# Altium schematic sheet IOProtection.SchDoc: Top Level
size A3; CompanyName: NOT USED; SheetNumber: 0; SheetTotal: 0; PageSetup: Record=PageOptions|CenterHorizontal=True|CenterVertical=True|PrintScale=1.00|XCorrection=1.00|YCorrection=1.00|PrintKind=0|BorderSize=5000000|LeftOffset=0|BottomOffset=0|Orientation=2|PaperLength=1000|PaperWidth=1000|Scale=100|PaperSource=7|PrintQuality=-4|MediaType=1|DitherType=10|PaperKind=A3|PrintScaleMode=0
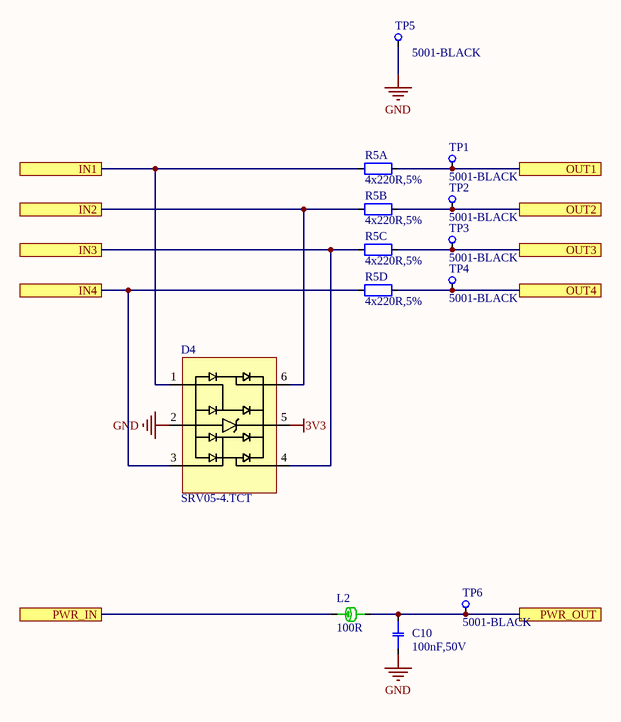
[diagram p0: IOProtection.SchDoc]

## Parts
C10  100nF,50V  [CAPC1608X09N_0603]
D4  SRV05-4.TCT  [SOT95P280X145-6N_SOT23-6]
L2  100R  [INDC1608X10N_0603]
R5  4x220R,5%  [RESCAF80P32X16X60N]  (parts A,B,C,D of 4)
TP1  5001-BLACK  [TP_5002]  (no BOM)
TP2  5001-BLACK  [TP_5002]  (no BOM)
TP3  5001-BLACK  [TP_5002]  (no BOM)
TP4  5001-BLACK  [TP_5002]  (no BOM)
TP5  5001-BLACK  [TP_5002]  (no BOM)
TP6  5001-BLACK  [TP_5002]  (no BOM)

## Ports
IN1, IN2, IN3, IN4, OUT1, OUT2, OUT3, OUT4, PWR_IN, PWR_OUT

## Nets
3V3: D4.5
GND: C10.1 D4.2 TP5.1
IN1: D4.1 R5.1 ; port IN1
IN2: D4.6 R5.2 ; port IN2
IN3: D4.4 R5.3 ; port IN3
IN4: D4.3 R5.4 ; port IN4
OUT1: R5.8 TP1.1 ; port OUT1
OUT2: R5.7 TP2.1 ; port OUT2
OUT3: R5.6 TP3.1 ; port OUT3
OUT4: R5.5 TP4.1 ; port OUT4
PWR_IN: L2.1 ; port PWR_IN
PWR_OUT: C10.2 L2.2 TP6.1 ; port PWR_OUT

## Notes on the sheet
- Project
- Size:
- Date:
- A3
- Revision:
- Sheet
- of
- Lambo
- File:

## Library data of the parts
C10 = CCH-104CH-G: CAP CER 0.1UF 50V 10% X7R 0603; Manufacturer: Kemet; Manufacturer Part Number: C0603C104K5RACTU; Type: Ceramic; Display_Name: 100nF,50V; Capacitance: 100nF; Dielectric: X7R; Tolerance: 10%; Voltage: 50V; BWA PN: CCH-104CH-G; Schematic Symbol: CAP-NP_1; Supplier 1: Digi-Key; Supplier Part Number 1: 399-5089-1-ND
D4 = DIO-10080-A: IC TVS ARRAY 4-LINE 5V SOT23-6; Manufacturer: Semtech; Display_Name: SRV05-4.TCT; Type: TVS; BWA PN: DIO-10080-A; Schematic Symbol: SRV05-4.TCT; Manufacturer Part Number: SRV05-4.TCT; Supplier 1: Digi-Key; Supplier Part Number 1: SRV05-4CT-ND
L2 = IND-10168-A: FERRITE BEAD 100 OHM 0603 1LN; Manufacturer: Murata; Manufacturer Part Number: BLM18EG101TN1D; Inductance: 100Ohm @ 100 MHz; Current Rating: 2000mA; DC Resistance: 45mOhm; Schematic Symbol: INDUCTOR_1; Display_Name: 100R; BWA PN: IND-10168-A; Supplier 1: Digi-Key; Supplier Part Number 1: 490-5978-1-ND
R5 = RAB-200R0-F: RES ARRAY 220 OHM 8TRM 4 RES SMD; Manufacturer: Yageo; Manufacturer Part Number: YC164-JR-07220RL; Resistance: 220R; Display_Name: 4x220R,5%; Tolerance: 5%; Type: Array; BWA PN: RAB-200R0-F; Schematic Symbol: RESISTOR_ARRAY_4X; Supplier 1: Digi-Key; Supplier Part Number 1: YC164J-220CT-ND
TP1-TP6 = CON-10768-A: PC TEST LOOP BLACK; Manufacturer: Keystone Electronics; Manufacturer Part Number: 5000; Contacts: 1; Display_Name: 5001-BLACK; Rows: 1; Type: Testpoint; BWA PN: CON-10768-A; Schematic Symbol: TP_1; Supplier 1: Digi-Key; Supplier Part Number 1: 36-5001-ND